# Altium schematic sheet gydrodrive_inputTrim.SchDoc
size 297 x 209 mm; SheetNumber: 5; SheetTotal: 22
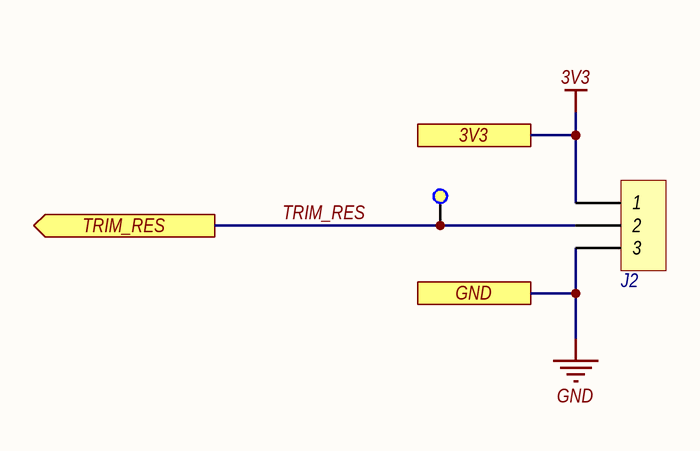
[diagram p0: gydrodrive_inputTrim.SchDoc]

## Parts
J2  DG142V-5.08-03P  [DG142V-5.08-03P]  (value not drawn)
TP5  Test point 1  [TP_1]  (value not drawn)  (no BOM)

## Ports
3V3 (see gydrodrive_main[4B], gydrodrive_button[3B], gydrodrive_can[3B], gydrodrive_debugger[3B], gydrodrive_encoder[1A], gydrodrive_indication[3C], gydrodrive_interfaces[3C], gydrodrive_mcu[4C], gydrodrive_rs485[4B], gydrodrive_sto[2B], gydrodrive_supply[5B]), GND (see gydrodrive_main[4B], gydrodrive_button[3C], gydrodrive_can[3C], gydrodrive_control[3B], gydrodrive_currentSource[2B], gydrodrive_debugger[4C], gydrodrive_discreteControl[3B], gydrodrive_encoder[1B], gydrodrive_i2c[5C], gydrodrive_indication[3C], gydrodrive_interfaces[3A], gydrodrive_linearPosSensor[2C], gydrodrive_mcu[6D], gydrodrive_reservedPins[2C], gydrodrive_rs485[3B], gydrodrive_sensor[3C], gydrodrive_sensors[2B], gydrodrive_sto[2C], gydrodrive_supply[2C], gydrodrive_uart[4C]), TRIM_RES (out, see gydrodrive_main[3B], gydrodrive_mcu[3B])

## Nets
3V3: J2.1 ; port 3V3
GND: J2.3 ; port GND
TRIM_RES: J2.2 TP5.1 ; port TRIM_RES

## Notes on the sheet
- Подп. и дата
- Инв. № дубл.
- Взам. инв. №
- Инв. № подл.
- Изм.
- Лист
- № докум.
- Подп.
- Дата
- Копировал
- Формат
- A4

## Library data of the parts
J2 = DG142V-5.08-03P: Клеммник 3-контактный, шаг 5.08 мм; Part Name: Клеммник DG142V-5.08-03P; Parameters: 8А; Max Price: 60; System: Connector; Part Number: DG142V-5.08-03P; Component Type: Standart; Pin Count: 3
TP5 = Test point 1: Тестовый контакт круглый 1 мм; Part Number: Test point 1; Part Name: Тестовый контакт; Component Type: Standart (No BOM)